# Altium project SC944D.PrjPCB (part 1 of 4)
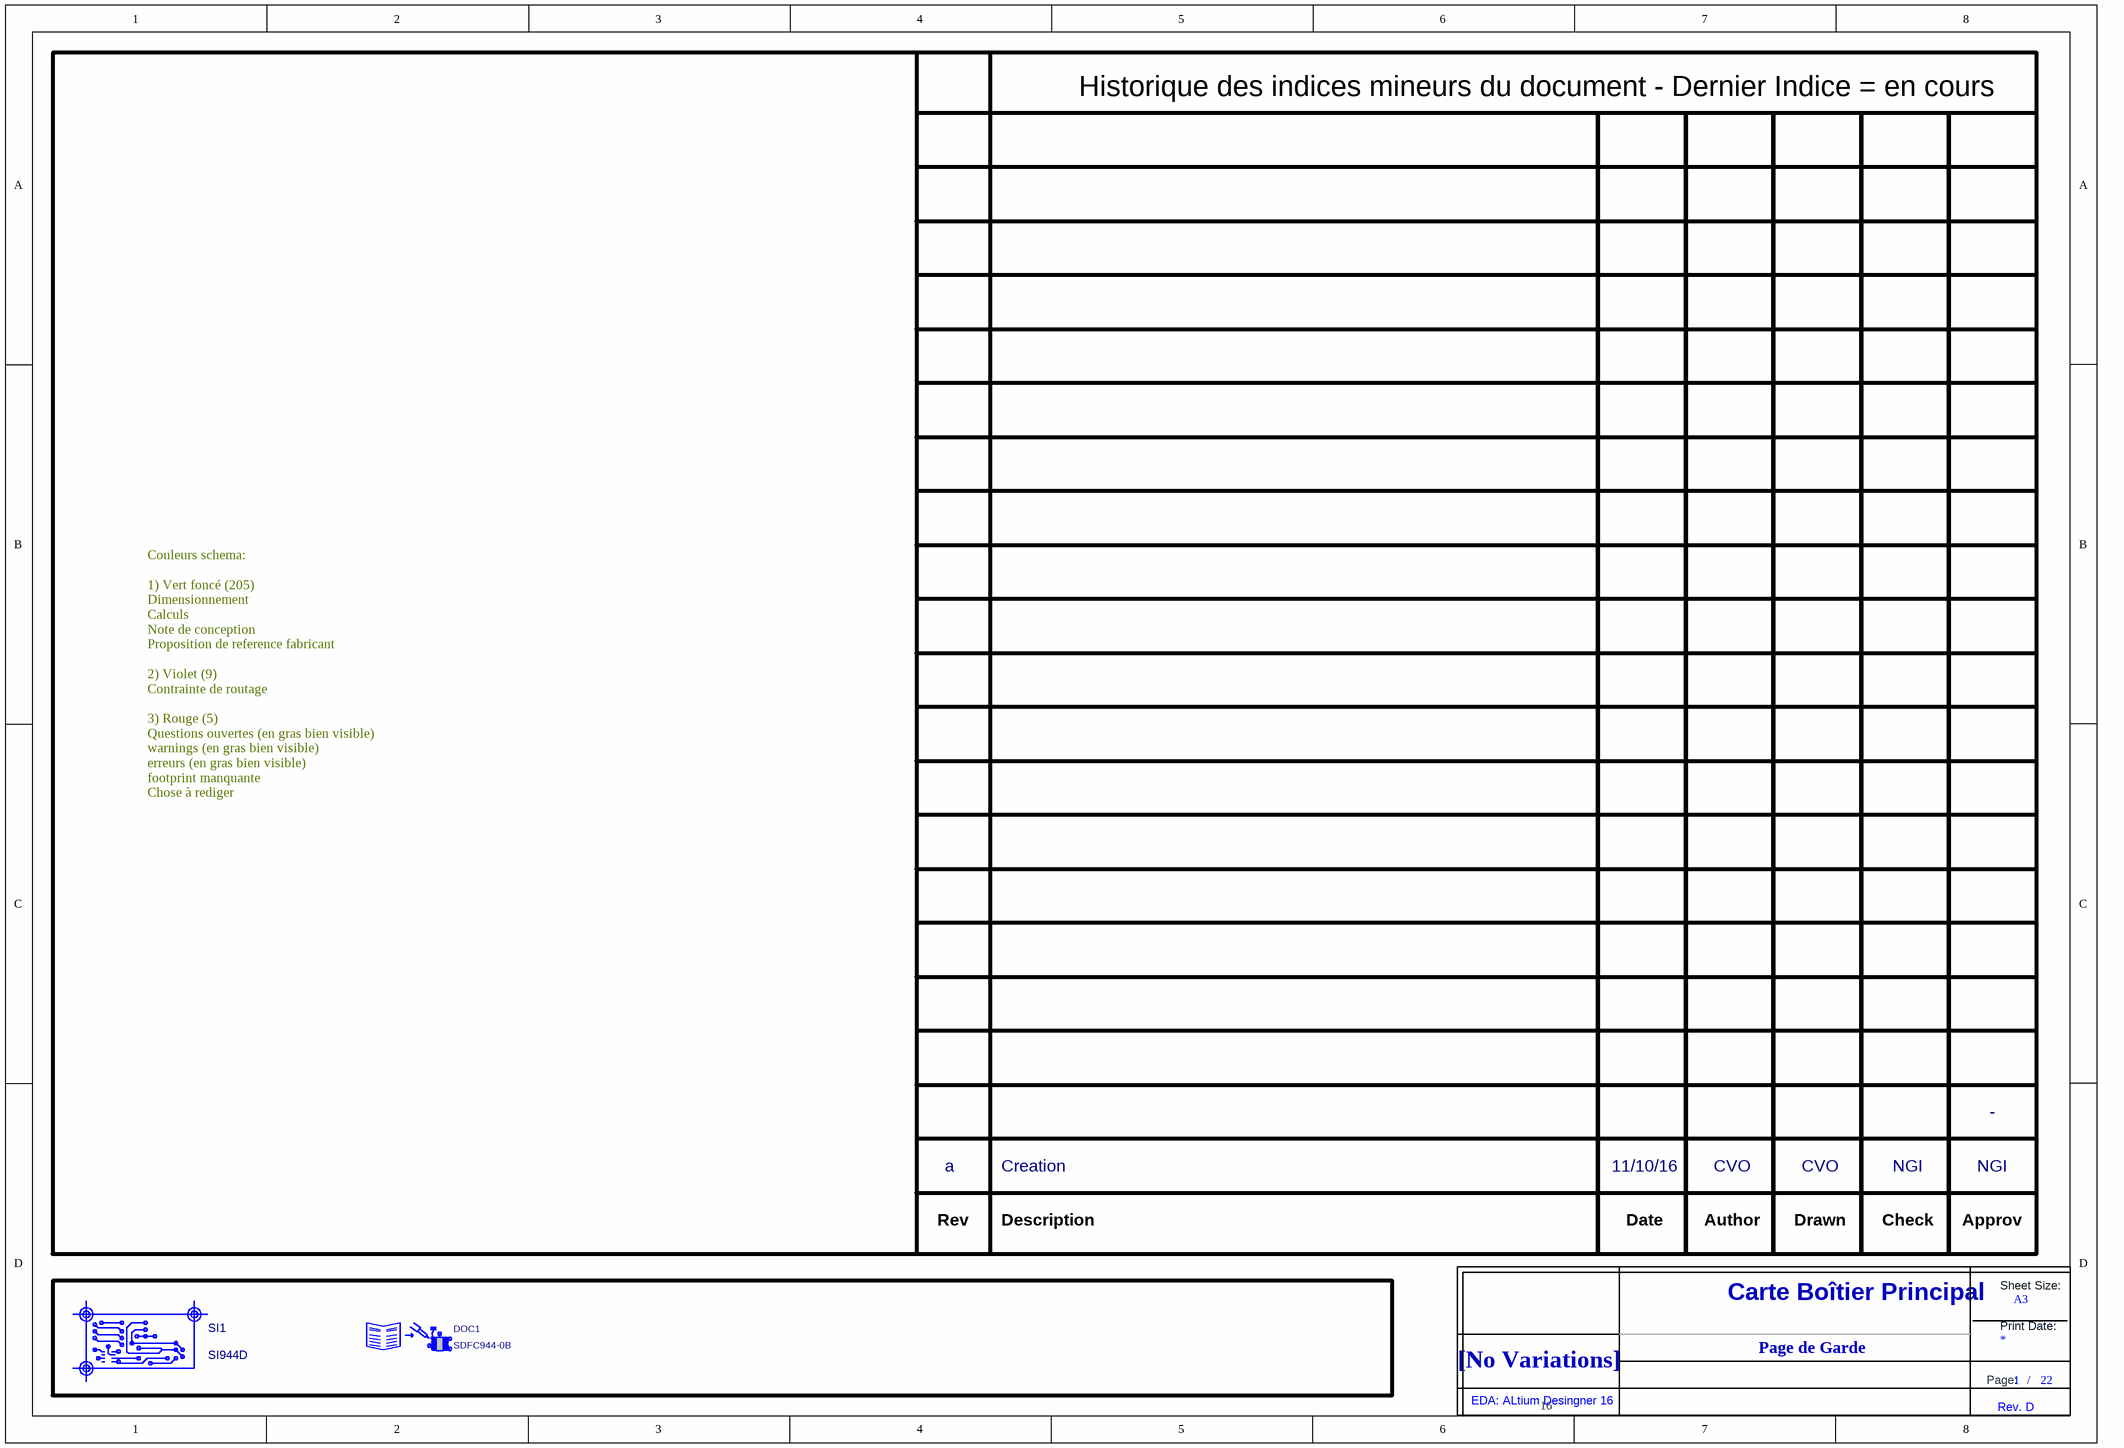
[diagram p0: SDEC944-xD_Page_de_Garde.SchDoc]
_Instructions_SC: Les dates et versions mineurs du SDEC (SC) sont � remplir sur la page ..._infos.doc; _Instructions_SI: Les dates et versions mineurs du SI sont � remplir dans la couche "Cartouche TOP"; prjPcbTitle0: Carte Bo�tier Principal; refSI1: SI944D; SDECSheetSize: A3; SISheetSize: A3
14 sheets, 417 parts. Net scope: global (net labels, ports and power ports of the same name join across sheets).
Board file: SI944D.PcbDoc
Sheets:
  SDEC944-xD_Page_de_Garde.SchDoc
  SDEC944-xD_Alimentation_1-2.SchDoc
  SDEC944-xD_Alimentation_2-2.SchDoc
  SDEC944-xD_Chargeur_Batterie.SchDoc
  SDEC944-xD_Coeur.SchDoc
  SDEC944-xD_Ethernet.SchDoc
  SDEC944-xD_Liaison_IHM.SchDoc
  SDEC944-xD_Arrosage_(detect_pluie+commande_vanne).SchDoc
  SDEC944-xD_Fil_Pilote_1-2_(commun).SchDoc
  SDEC944-xD_Fil_Pilote_2-2_(zone_jour).SchDoc
  SDEC944-xD_Machines_laver_2-2_(commande).SchDoc
  SDEC944-xD_Cumulus.SchDoc
  SDEC944-xD_Porte_tableau_domotique_(ouverture).SchDoc
  SDEC944-xD_Borniers.SchDoc

## Sheet SDEC944-xD_Page_de_Garde.SchDoc: Page de Garde
size 393 x 270 mm; CompanyName: Seccom; Address1: 521, rue du capt. François Garbit; Address2: 69440 Mornant; Address3: seccom@seccom.fr; Address4: www.seccom.fr; DocumentNumber: 1; SheetNumber: 1; SheetTotal: 22; PageSetup: Record=PageOptions|CenterHorizontal=True|CenterVertical=True|PrintScale=0.74|XCorrection=1.00|YCorrection=1.00|PrintKind=0|BorderSize=5000000|LeftOffset=0|BottomOffset=0|Orientation=2|PaperLength=1000|PaperWidth=1000|Scale=100|PaperSource=7|PrintQuality=-4|MediaType=1|DitherType=10|PaperKind=A4|PrintScaleMode=1

### Parts
(Parts that share a designator on the sheet are numbered #1, #2 ... from top to bottom, then left to right.)
DOC1  Reference: SDFC944-0B  (hidden comment: DOCUMENT_FAB_CARTE_SDFC)  (mechanical)
MIR1  MIRE_PICK-N-PLACE  [MIRE_PICK-N-PLACE_D1MM_VE3MM]  (value not drawn)
MIR2  MIRE_PICK-N-PLACE  [MIRE_PICK-N-PLACE_D1MM_VE3MM]  (value not drawn)
MIR3  MIRE_PICK-N-PLACE  [MIRE_PICK-N-PLACE_D1MM_VE3MM]  (value not drawn)
SI1  Reference: SI944D  [CIRCUIT_IMPRIME_SI_STD]
Title_new#1  DNI  (value not drawn)  (graphical)

### Notes on the sheet
- Historique des indices mineurs du document - Dernier Indice = en cours
- Couleurs schema:
  1) Vert foncé (205)
  Dimensionnement
  Calculs
  Note de conception
  Proposition de reference fabricant
  2) Violet (9)
  Contrainte de routage
  3) Rouge (5)
  Questions ouvertes (en gras bien visible)
  warnings (en gras bien visible)
  erreurs (en gras bien visible)
  footprint manquante
  Chose à rediger
- -
- a
- Creation
- 11/10/16
- CVO
- NGI
- Rev
- Description
- Date
- Author
- Drawn
- Check
- Approv
- Page de Garde
- 16
- (in symbol Title_new) Sheet Size:; Carte Boîtier Principal; A3; Print Date:; [No Variations]; Page:; /; EDA: ALtium Desingner 16; Rev. D

### Library data of the parts
DOC1 = DOCUMENT_FAB_CARTE_SDFC: Document de Fabrication pour la Carte SC{Num SC}-{Version SC}; Creation: LJ; Coeff: 0; Verification: *; Boitier: *; Fabricant: *; Ref Fab: *; Config: *; ComponentLink1URL: http://192.168.0.202/index.php/Accueil; ComponentLink2URL: http://192.168.0.202/index.php/Accueil; ComponentLink1Description: Datasheet; ComponentLink2Description: Datasheet Boitier
MIR1-MIR3 = MIRE_PICK-N-PLACE: Mire pour machine de placement CMS "Pick'n Place"; Creation: LJ (25/10/12); Config: NC; Coeff: 0; Value: *
SI1 = CIRCUIT_IMPRIME_MODEL: Circuit Imprimé Seccom; Creation: LJ; Verification: LJ (15/11/04); Remarque: {Remarque}; Coeff: 1; Value: *; Boitier: *; Fabricant: *; Ref Fab: *; ComponentLink1URL: \\SRV_backup\datasheet\; ComponentLink2URL: \\SRV_backup\datasheet\_BOITIERS\; Config: *; ComponentLink1Description: Datasheet; ComponentLink2Description: Datasheet Boitier
Title_new#1 = Title_new

## Sheet SDEC944-xD_Alimentation_1-2.SchDoc: Alimentation 1/2
size 393 x 270 mm; CompanyName: Seccom; Address1: 521, rue du capt. François Garbit; Address2: 69440 Mornant; Address3: seccom@seccom.fr; Address4: www.seccom.fr; DocumentNumber: 2; SheetNumber: 2; SheetTotal: 22; PageSetup: Record=PageOptions|CenterHorizontal=True|CenterVertical=True|PrintScale=0.74|XCorrection=1.00|YCorrection=1.00|PrintKind=0|BorderSize=5000000|LeftOffset=0|BottomOffset=0|Orientation=2|PaperLength=1000|PaperWidth=1000|Scale=100|PaperSource=7|PrintQuality=-4|MediaType=1|DitherType=10|PaperKind=A4|PrintScaleMode=1
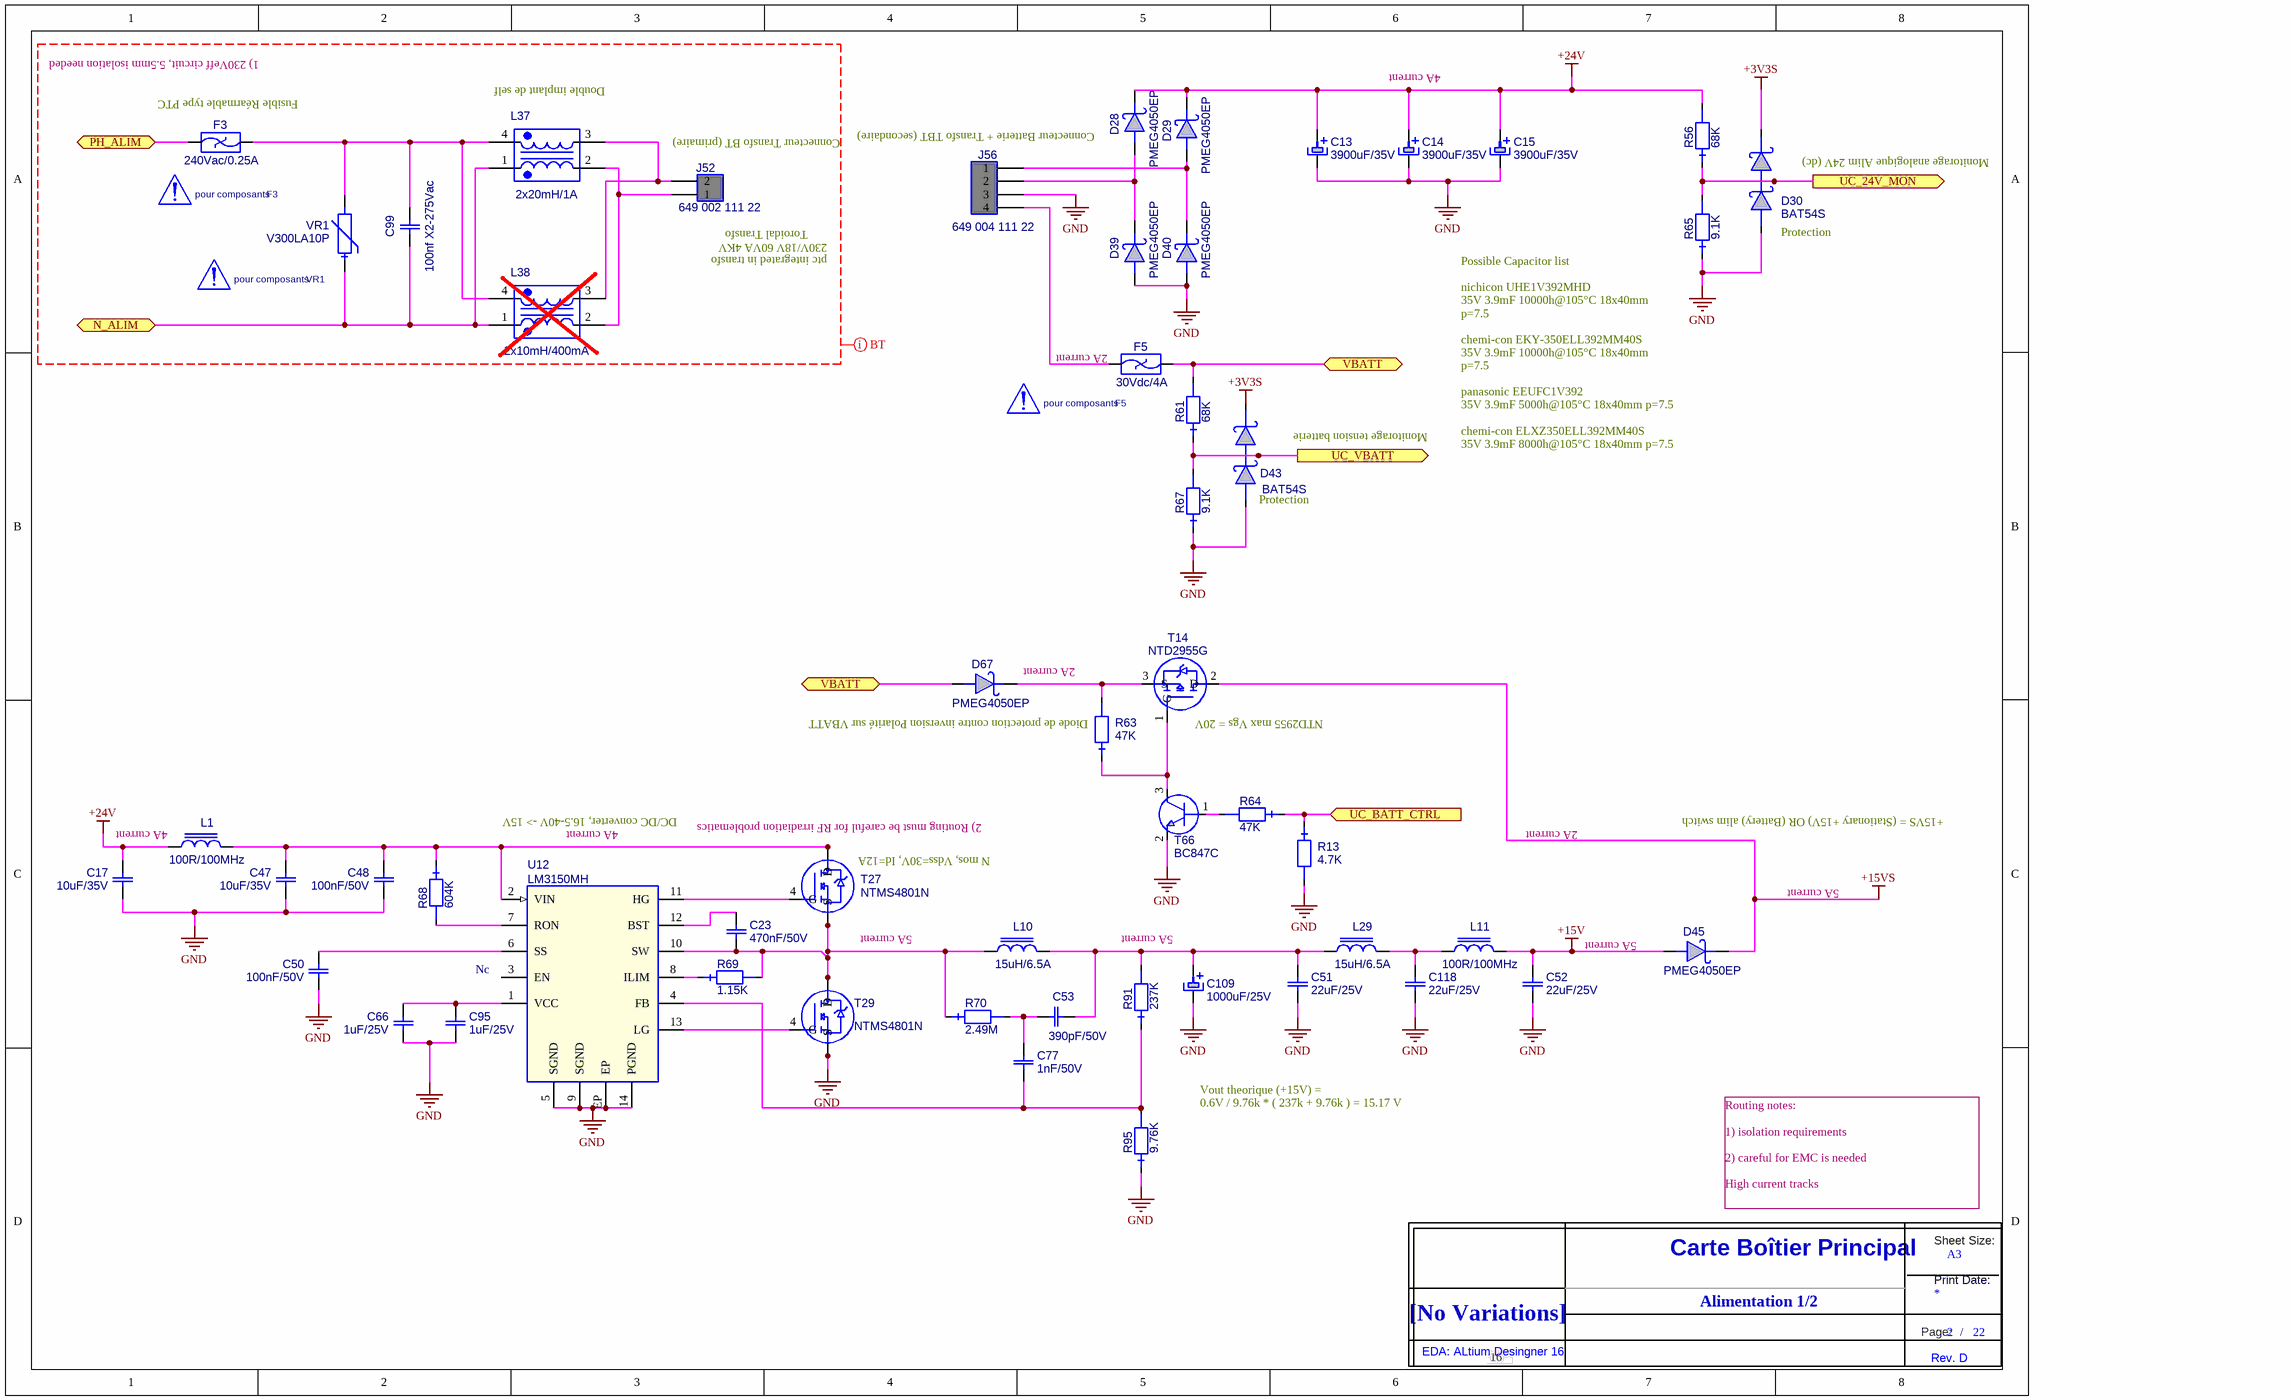
[diagram p1: SDEC944-xD_Alimentation_1-2.SchDoc]

### Parts
(Parts that share a designator on the sheet are numbered #1, #2 ... from top to bottom, then left to right.)
C13  value 3900uF/35V  [CAP_ELE_18X40_E7.5MM]  (hidden comment: C_ELE_3900U_35V_UHE1V392MD)
C14  value 3900uF/35V  [CAP_ELE_18X40_E7.5MM]  (hidden comment: C_ELE_3900U_35V_UHE1V392MD)
C15  value 3900uF/35V  [CAP_ELE_18X40_E7.5MM]  (hidden comment: C_ELE_3900U_35V_UHE1V392MD)
C17  value 10uF/35V  [1210_ReflowSoldering_CAP]  (hidden comment: C_1210_X5R_10%_10U-35V)
C23  value 470nF/50V  [0805_ReflowSoldering_CAP]  (hidden comment: C_0805_X7R_10%_470N-50V)
C47  value 10uF/35V  [1210_ReflowSoldering_CAP]  (hidden comment: C_1210_X5R_10%_10U-35V)
C48  value 100nF/50V  [0603_ReflowSoldering_CAP]  (hidden comment: C_0603_X7R_10%_100N-50V)
C50  value 100nF/50V  [0603_ReflowSoldering_CAP]  (hidden comment: C_0603_X7R_10%_100N-50V)
C51  value 22uF/25V  [1206_ReflowSoldering_CAP]  (hidden comment: C_1206_X5R_20%_22U-25V)
C52  value 22uF/25V  [1206_ReflowSoldering_CAP]  (hidden comment: C_1206_X5R_20%_22U-25V)
C53  value 390pF/50V  [0603_ReflowSoldering_CAP]  (hidden comment: C_0603_NPO_5%_390P-50V)
C66  value 1uF/25V  [0805_ReflowSoldering_CAP]  (hidden comment: C_0805_X5R_10%_1U-25V)
C77  value 1nF/50V  [0603_ReflowSoldering_CAP]  (hidden comment: C_0603_NPO_5%_1N-50V)
C95  value 1uF/25V  [0805_ReflowSoldering_CAP]  (hidden comment: C_0805_X5R_10%_1U-25V)
C99  value 100nf X2-275Vac  [CAP_S_5X17.5_E15MM]  (hidden comment: C_X2_GEN_100NF-275Vac_(4KVmax))
C109  value 1000uF/25V  [CAP_ELE_10X31.5_E5.08MM]  (hidden comment: C_ELE_GEN_20%_1000U-25V)
C118  value 22uF/25V  [1206_ReflowSoldering_CAP]  (hidden comment: C_1206_X5R_20%_22U-25V)
D28  PMEG4050EP  [SOD128_ReflowSoldering]
D29  PMEG4050EP  [SOD128_ReflowSoldering]
D30  BAT54S  [SOT23_3L_ReflowSoldering]
D39  PMEG4050EP  [SOD128_ReflowSoldering]
D40  PMEG4050EP  [SOD128_ReflowSoldering]
D43  BAT54S  [SOT23_3L_ReflowSoldering]
D45  PMEG4050EP  [SOD128_ReflowSoldering]
D67  PMEG4050EP  [SOD128_ReflowSoldering]
F3  value 240Vac/0.25A  [Fus_Poly_11.4x3.8_h19_e5.8]  (hidden comment: FUSIBLE_POLY_240Vac_0.25A_LVR)
F5  value 30Vdc/4A  [Fus_Poly_14.4x3_h24.8_e5.08]  (hidden comment: FUSIBLE_POLY_30V_4A_MF-R400)
J52  value 649 002 111 22  [WR_MPC4_1X02D_Oval_Pad]  (hidden comment: EMB_4.20_M_D_1X02_Oval_PAD)
J56  value 649 004 111 22  [WR_MPC4_1X04D_Oval_PAD]  (hidden comment: EMB_4.20_M_D_1X04_Oval_Pad)
L1  value 100R/100MHz  [1812_ReflowSoldering_SELF]  (hidden comment: IND_FERRITE_1812_74279226101)
L10  value 15uH/6.5A  [SELF_WEPD_12X12_h10_XXL]  (hidden comment: SELF_15UH_6.5A_7447709150)
L11  value 100R/100MHz  [1812_ReflowSoldering_SELF]  (hidden comment: IND_FERRITE_1812_74279226101)
L29  value 15uH/6.5A  [SELF_WEPD_12X12_h10_XXL]  (hidden comment: SELF_15UH_6.5A_7447709150)
L37  value 2x20mH/1A  [SELF_PM3700_17.78x11.43H11.43]  (hidden comment: IND_FERRITE_PM3700_80_RC_2X20mH)
L38  value 2x10mH/400mA  [SELF_WE-LF_SH_18.5x23.3H11.5mm]  (hidden comment: IND_FERRITE_WE_LF_SH_7446631010_2X10mH)  (no BOM)
NOTE1  value F5  [NULL]  (hidden comment: NOTE_POUR_NOMENCLATURE_COMP)
NOTE2  value VR1  [NULL]  (hidden comment: NOTE_POUR_NOMENCLATURE_COMP)
NOTE3  value F3  [NULL]  (hidden comment: NOTE_POUR_NOMENCLATURE_COMP)
R13  value 4.7K  [0603_ReflowSoldering_RES]  (hidden comment: RES_0603_1%_100PPM_4.7K)
R56  value 68K  [0603_ReflowSoldering_RES]  (hidden comment: RES_0603_1%_100PPM_68K)
R61  value 68K  [0603_ReflowSoldering_RES]  (hidden comment: RES_0603_1%_100PPM_68K)
R63  value 47K  [0603_ReflowSoldering_RES]  (hidden comment: RES_0603_1%_100PPM_47K)
R64  value 47K  [0603_ReflowSoldering_RES]  (hidden comment: RES_0603_1%_100PPM_47K)
R65  value 9.1K  [0603_ReflowSoldering_RES]  (hidden comment: RES_0603_1%_100PPM_9.1K)
R67  value 9.1K  [0603_ReflowSoldering_RES]  (hidden comment: RES_0603_1%_100PPM_9.1K)
R68  value 604K  [0603_ReflowSoldering_RES]  (hidden comment: RES_0603_1%_100PPM_604K)
R69  value 1.15K  [0603_ReflowSoldering_RES]  (hidden comment: RES_0603_1%_100PPM_1.15K)
R70  value 2.49M  [0603_ReflowSoldering_RES]  (hidden comment: RES_0603_1%_100PPM_2.49M)
R91  value 237K  [0603_ReflowSoldering_RES]  (hidden comment: RES_0603_1%_100PPM_237K)
R95  value 9.76K  [0603_ReflowSoldering_RES]  (hidden comment: RES_0603_1%_100PPM_9.76K)
T14  NTD2955G  [DPAK_Specifique_1]
T27  NTMS4801N  [SOIC_08_E1,27_L150_ReflowSoldering]
T29  NTMS4801N  [SOIC_08_E1,27_L150_ReflowSoldering]
T66  BC847C  [SOT23_3L_ReflowSoldering]
Title_new#2  DNI  (value not drawn)  (graphical)
U12  value LM3150MH  [eTSSOP_014_E0,65_L4,4MM]  (hidden comment: LM3150)
VR1  value V300LA10P  [VDR_Serie_LA_d10_h16_e7.5mm]  (hidden comment: VDR_V300LA10P)

### Ports
N_ALIM (bidir), PH_ALIM (bidir), UC_24V_MON (out), UC_BATT_CTRL (in), UC_VBATT (out), VBATT (bidir)

### Nets
+3V3S: D30.2 D43.2
+15V: C52.2 D45.A L11.2
+15VS: D45.K T14.2(D)
+24V: C13.2 C14.2 C15.2 C17.2 D28.K D29.K L1.1 R56.2
GND: C13.1 C14.1 C15.1 C17.1 C47.1 C48.2 C50.2 C51.1 C52.1 C66.1 C95.1 C109.1 C118.1 D30.1 D39.A D40.A D43.1 J56.3 R13.2 R65.1 R67.1 R95.1 T29.1(S) T29.2(S) T29.3(S) T66.2(E) U12.5(SGND) U12.9(SGND) U12.14(PGND) U12.EP
N_ALIM: C99.2 L37.1 L38.1 VR1.1 ; port N_ALIM
PH_ALIM: F3.1 ; port PH_ALIM
UC_24V_MON: D30.3 R56.1 R65.2 ; port UC_24V_MON
UC_BATT_CTRL: R13.1 R64.1 ; port UC_BATT_CTRL
UC_VBATT: D43.3 R61.1 R67.2 ; port UC_VBATT
VBATT: D67.A F5.2 R61.2 ; port VBATT
NetC23_1: C23.1 L10.1 R69.2 R70.1 T27.1(S) T27.2(S) T27.3(S) T29.5(D) T29.6(D) T29.7(D) T29.8(D) U12.10(SW)
NetC23_2: C23.2 U12.12(BST)
NetC47_2: C47.2 C48.1 L1.2 R68.1 T27.5(D) T27.6(D) T27.7(D) T27.8(D) U12.2(VIN)
NetC50_1: C50.1 U12.6(SS)
NetC51_2: C51.2 C53.1 C109.2 L10.2 L29.1 R91.2
NetC53_2: C53.2 C77.2 R70.2
NetC66_2: C66.2 C95.2 U12.1(VCC)
NetC77_1: C77.1 R91.1 R95.2 U12.4(FB)
NetC99_1: C99.1 F3.2 L37.4 L38.4 VR1.2
NetC118_2: C118.2 L11.1 L29.2
NetD28_A: D28.A D39.K J56.2
NetD29_A: D29.A D40.K J56.1
NetD67_K: D67.K R63.2 T14.3(S)
NetF5_1: F5.1 J56.4
NetJ52_1: J52.1 L37.2 L38.2
NetJ52_2: J52.2 L37.3 L38.3
NetR63_1: R63.1 T14.1(G) T66.3(C)
NetR64_2: R64.2 T66.1(B)
NetR68_2: R68.2 U12.7(RON)
NetR69_1: R69.1 U12.8(ILIM)
NetT27_4: T27.4(G) U12.11(HG)
NetT29_4: T29.4(G) U12.13(LG)

Not connected (* = marked no-connect by the designer): L10 3 4 5 6; L29 3 4 5 6; U12 3(EN)

### Layout directives
net class BT: (no net found under the mark)

### Notes on the sheet
- 1) 230Veff circuit, 5.5mm isolation needed
- (near F3) Fusible Réarmable type PTC
- (near L37) Double implant de self
- 4A current
- (near J52) Connecteur Transfo BT (primaire)
- Connecteur Batterie + Transfo TBT (secondaire)
- (near D30) Monitorage analogique Alim 24V (dc)
- (near J52) Toroidal Transfo
- ptc integrated in transfo
- 230V/18V 60VA 4KV
- (near D30) Protection
- (near F5) 2A current
- (near D43) Monitorage tension batterie
- (near D43) Protection
- (near R65) Possible Capacitor list
  nichicon UHE1V392MHD
  35V 3.9mF 10000h@105°C 18x40mm p=7.5
  chemi-con EKY-350ELL392MM40S
  35V 3.9mF 10000h@105°C 18x40mm p=7.5
  panasonic EEUFC1V392
  35V 3.9mF 5000h@105°C 18x40mm p=7.5
  chemi-con ELXZ350ELL392MM40S
  35V 3.9mF 8000h@105°C 18x40mm p=7.5
  Verifier ripple max (mAmps)
- (near D67) 2A current
- (near R63) Diode de protection contre inversion Polarité sur VBATT
- (near T14) NTD2955 max Vgs = 20V
- (near L1) 4A current
- DC/DC converter, 16.5-40V -> 15V
- (near T27) 2) Routing must be careful for RF irradiation problematics
- 2A current
- +15VS = (Stationary +15V) OR (Battery) alim switch
- (near T27) N mos, Vdss=30V, Id=12A
- 5A current
- Nc
- Vout theorique (+15V) =
  0.6V / 9.76k * ( 237k + 9.76k ) = 15.17 V
- Routing notes:
  1) isolation requirements
  2) careful for EMC is needed
  High current tracks
- Alimentation 1/2
- 16
- (in symbol NOTE_POUR_NOMENCLATURE_COMP) pour composants
- (in symbol Title_new) Sheet Size:; Carte Boîtier Principal; A3; Print Date:; [No Variations]; Page:; /; EDA: ALtium Desingner 16; Rev. D

### Library data of the parts
C13-C15 = C_ELE_3900U_35V_UHE1V392MD: Condensateurs électrolytiques aluminium traversant 35volts 3900uF 105c 18x40 P7.5; Creation: PDP (02/12/10); Boitier: 18x40mm p7.5mm; Remarque: {Remarque}; Fabricant: Nichicon; Ref Fab: UHE1V392MHD; Coeff: 1; Config: *; ComponentLink1Description: Datasheet; ComponentLink1URL: O:\_Documentation\Datasheets\Nichicon\e-he nichicon.pdf; ComponentLink2Description: Datasheet Boitier; ComponentLink2URL: o:\_Documentation\Datasheets\_BOITIERS\; Supplier 1: Mouser; Supplier Part Number 1: 647-UHE1V392MHD
C17 C47 = C_1210_X5R_10%_10U-35V: Condensateur céramique, X5R, 10%, CMS 1210; Creation: LJ (09/02/09); Reference: 000265/00; Boitier: 1210; Remarque: {Remarque}; Coeff: 1; Fabricant: Taiyo Yuden; Ref Fab: GMK325BJ106KN-T; Verification: *; ComponentLink1URL: o:\_Documentation\Datasheets\TaiyoYuden\High_Value_Multilayer_Ceramic_Caps.pdf; ComponentLink2URL: o:\_Documentation\Datasheets\_Boitiers\PASSIF_CMS\C_1210_(3,2x2,5)_(Schneider).pdf; Config: *; ComponentLink1Description: Datasheet; ComponentLink2Description: Datasheet Boitier
C23 = C_0805_X7R_10%_470N-50V: Condensateur céramique, X7R, 10%, CMS 0805, 470nF/50V; Creation: FB (02/10/12); Boitier: 0805; Remarque: {Remarque}; Coeff: 1; Fabricant: Kemet; Ref Fab: C0805C471K5RAC; Verification: *; ComponentLink1URL: O:\_Documentation\Datasheets\Kemet\Condos_Ceramic_CMS.pdf; ComponentLink2URL: o:\_Documentation\Datasheets\_BOITIERS\PASSIF_CMS\RC_0805_(2x1,25)_(Schneider).PDF; Config: *; ComponentLink1Description: Datasheet; ComponentLink2Description: Datasheet Boitier; Supplier 1: Mouser; Supplier Part Number 1: 80-C0805C471K5R
C48 C50 = C_0603_X7R_10%_100N-50V: Condensateur céramique, X7R, 10%, CMS 0603, 100nF/50V; Creation: FB (29/02/12); Boitier: 0603; Remarque: {Remarque}; Fabricant: Kemet; Ref Fab: C0603C104K5RAC; Coeff: 1; ComponentLink1URL: O:\_Documentation\Datasheets\Kemet\Condos_Ceramic_CMS.pdf; ComponentLink2URL: o:\_Documentation\Datasheets\_BOITIERS\PASSIF_CMS\; Config: *; ComponentLink1Description: Datasheet; ComponentLink2Description: Datasheet Boitier; Supplier 1: Farnell; Supplier Part Number 1: 1288255
C51 C52 C118 = C_1206_X5R_20%_22U-25V: Condensateur céramique, X5R, 20%, CMS 1206, 22uF/25V; Creation: ZA (18/12/13); Reference: /01; Boitier: 1206; Remarque: {Remarque}; Fabricant: TDK; Coeff: 1; Ref Fab: C3216X5R1E226M160AB; Verification: *; ComponentLink1URL: O:\_Documentation\Datasheets\TDK\general_B11.pdf; ComponentLink2URL: o:\_Documentation\Datasheets\_BOITIERS\PASSIF_CMS\; ComponentLink1Description: Datasheet; ComponentLink2Description: Datasheet Boitier; Supplier 1: Farnell; Supplier Part Number 1: 2354129; Supplier 2: Mouser; Supplier Part Number 2: 810-C3216X5R1E226M
C53 = C_0603_NPO_5%_390P-50V: Condensateur céramique, NPO, 5%, CMS 0603; Creation: CHD; Boitier: 0603; Remarque: {Remarque}; Coeff: 1; Fabricant: Kemet; Ref Fab: C0603C391J5GAC; ComponentLink1URL: o:\_Documentation\Datasheets\Kemet\Condos_Ceramic_CMS.pdf; ComponentLink2URL: o:\_Documentation\Datasheets\_BOITIERS\PASSIF_CMS\; Config: *; ComponentLink1Description: Datasheet; ComponentLink2Description: Datasheet Boitier; Supplier 1: Farnell; Supplier 2: Mouser; Supplier Part Number 1: 1414638; Supplier Part Number 2: 80-C0603C391J5G
C66 C95 = C_0805_X5R_10%_1U-25V: Condensateur céramique, X5R, 10%, CMS 0805; Creation: FB (07/03/12); Reference: 001834/00; Boitier: 0805; Remarque: {Remarque}; Coeff: 1; Fabricant: AVX; Ref Fab: 08053D105KAT2A; Verification: *; ComponentLink1URL: O:\_Documentation\Datasheets\AVX\Condensateurs_CMS_Ceramic_X5R.pdf; ComponentLink2URL: o:\_Documentation\Datasheets\_Boitiers\PASSIF_CMS\RC_0805_(2x1,25)_(Schneider).pdf; Config: *; ComponentLink1Description: Datasheet; ComponentLink2Description: Datasheet Boitier; Supplier Part Number 1: 1327695; Supplier Part Number 2: 6983409; Supplier 1: Farnell; Supplier 2: Radiospares
C77 = C_0603_NPO_5%_1N-50V: Condensateur céramique, NPO, 5%, CMS 0603; Creation: LJ; Reference: 001809/00; Boitier: 0603; Remarque: {Remarque}; Coeff: 1; Fabricant: AVX; Ref Fab: 06035A102JAT2A; ComponentLink1URL: o:\_Documentation\Datasheets\BC_Components\Condo_CMS_NPO-X7R-Y5V.pdf; ComponentLink2URL: o:\_Documentation\Datasheets\_BOITIERS\PASSIF_CMS\; Config: *; ComponentLink1Description: Datasheet; ComponentLink2Description: Datasheet Boitier; Supplier 1: Mouser; Supplier Part Number 1: 581-06035A102J
C99 = C_X2_GEN_100NF-275Vac_(4KVmax): Condensateur polypropylene métallisé X2, 20%,100nF/275Vac,-40/+110°C, radial; Creation: ZA (02/10/12); Reference: 001910/00; Boitier: 17.5x5_h12_e15_p0.9mm; Remarque: existe en 10%; Fabricant: Panasonic; Ref Fab: ECQUAAF104M; Coeff: 1; ComponentLink1URL: o:\_Documentation\Datasheets\Panasonic\CONDO_SERIE_ECQUA_X2.pdf; ComponentLink2URL: o:\_Documentation\Datasheets\Panasonic\CONDO_SERIE_ECQUA_X2.pdf; ComponentLink1Description: Datasheet; ComponentLink2Description: Datasheet Boitier; Supplier 1: Mouser; Supplier Part Number 1: 667-ECQ-UAAF104M; Supplier 2: Farnell; Supplier Part Number 2: 1907246
C109 = C_ELE_GEN_20%_1000U-25V: Condensateur Electro, ultra Low ESR (31mR@100kHz), +/-20%, 7000h, 1.9ARms, -40/+105°C; Creation: ZA (12/04/13); Boitier: d10_h31.5_e5mm; Remarque: {Remarque}; Fabricant: Nichicon; Ref Fab: UHE1E102MPD; Coeff: 1; Verification: *; Reference: *; Config: *; ComponentLink1Description: Datasheet; ComponentLink1URL: o:\_Documentation\Datasheets\Nichicon\e-he_nichicon.pdf; ComponentLink2Description: Datasheet Boitier; ComponentLink2URL: o:\_Documentation\Datasheets\_BOITIERS\; Supplier 1: Farnell; Supplier Part Number 1: 1823555; Supplier 2: Mouser; Supplier Part Number 2: 647-UHE1E102MPD
D28 D29 D39 D40 D45 D67 = PMEG4050EP: Diode Schottky, Vrrm=30V, If=5A(aver), Vf=0.315V, CMS; Creation: PDP (25/09/12); Boitier: SOD128; Remarque: {Remarque}; Coeff: 1; Fabricant: NXP; Verification: *; ComponentLink1URL: o:\_Documentation\Datasheets\NXP\PMEG4050EP.pdf; ComponentLink2URL: o:\_Documentation\Datasheets\_BOITIERS\ACTIF_CMS\SOD\; Config: *; ComponentLink1Description: Datasheet; ComponentLink2Description: Datasheet Boitier; Ref Fab: PMEG4050EP; Value: PMEG4050EP; Supplier 1: Mouser; Supplier 2: Farnell; Supplier Part Number 1: 771-PMEG4050EP115; Supplier Part Number 2: 1829203RL
D30 D43 = BAT54S: Diode Schottky double, BAT54 en série, Vrrm=30V, If=200mA, Vf=0.4Vmax, CMS; Creation: JMP 05/09/2002; Verification: GO (26/09/02); Reference: 000206/00; Boitier: SOT23_3L; Remarque: {Remarque}; Coeff: 1; Fabricant: NXP; ComponentLink1URL: O:\_Documentation\Datasheets\NXP\BAT54_series.pdf; ComponentLink2URL: o:\_Documentation\Datasheets\_BOITIERS\ACTIF_CMS\SOT\SOT_23_3P_(Schneider).PDF; Config: *; ComponentLink1Description: Datasheet; ComponentLink2Description: Datasheet Boitier; Ref Fab: BAT54S; Supplier 1: Farnell; Supplier Part Number 1: 1081194; Value: BAT54S; Supplier 2: Mouser; Supplier Part Number 2: 771-BAT54S-T/R
F3 = FUSIBLE_POLY_240Vac_0.25A_LVR: Fusible Polyswitch série LVR, Vmax=265Vac, Ihold=0.25A, Itrip=0.56A, 1.5W; Creation: ZA (23/04/13); Boitier: type R8 : 11.4x3.8_e5.08mm, H19; Remarque: {Remarque}; Coeff: 1; Fabricant: TYCO Electronics; Ref Fab: LVR025K; Verification: *; Config: *; ComponentLink1Description: Datasheet; ComponentLink1URL: o:\_Documentation\Datasheets\Tyco\Tyco=TE Connectivity\Polyswitch_LVR.pdf; ComponentLink2Description: Datasheet Boitier; ComponentLink2URL: o:\_Documentation\Datasheets\_BOITIERS\; Supplier 1: Farnell; Supplier Part Number 1: 1175835; Supplier 2: Mouser; Supplier Part Number 2: 650-LVR025K-2
F5 = FUSIBLE_POLY_30V_4A_MF-R400: Fusible Polyswitch, 30Vcc, Ihold=4A, Itrip=8A; Creation: ZA (31/10/12); Boitier: 14.4x3.1_e5.08mm; Remarque: {Remarque}; Coeff: 1; Fabricant: Bourns; Verification: *; ComponentLink1URL: o:\_Documentation\Datasheets\Bourns\POLYSWITCH_MFR.pdf; ComponentLink2URL: o:\_Documentation\Datasheets\_BOITIERS\; Config: *; ComponentLink1Description: Datasheet; ComponentLink2Description: Datasheet Boitier; Ref Fab: MF-R400; Supplier 1: Farnell; Supplier Part Number 1: 9350527; Supplier 2: Mouser; Supplier Part Number 2: 652-MFR400
J52 = EMB_4.20_M_D_1X02_Oval_PAD: Connecteur Wurth, pas 4.2mm, 1x2 picots, 9A, 600V; Creation: ZA (04/10/12); Boitier: 9.6x5.4_h12.8mm; Coeff: 1; Fabricant: Wurth Electronik; Ref Fab: 64900211122; ComponentLink1URL: O:\_Documentation\Datasheets\Wurth_Elektronik\6490xx11122.pdf; Config: *; ComponentLink1Description: Datasheet; ComponentLink2Description: Datasheet Boitier; Supplier 1: Farnell; Supplier Part Number 1: 2113396
J56 = EMB_4.20_M_D_1X04_Oval_Pad: Connecteur Wurth, pas 4.2mm, 1x4 picots, 8A; Creation: ZA (29/10/12); Boitier: 18x5.4_h12.8mm; Coeff: 1; Fabricant: Wurth Electronik; Ref Fab: 64900411122; ComponentLink1URL: O:\_Documentation\Datasheets\Wurth_Elektronik\6490xx11122.pdf; Config: *; ComponentLink1Description: Datasheet; ComponentLink2Description: Datasheet Boitier; Supplier 1: Farnell; Supplier Part Number 1: 2113398
L1 L11 = IND_FERRITE_1812_74279226101: Inductance à ferrite multicouches CMS, imp=100R@>100MHz, +/-25%, Rdc=6mR, I=8A; Creation: PDP (20/09/12); Boitier: 1812; Coeff: 1; Fabricant: Wurth Elektronik; ComponentLink1URL: O:\_Documentation\Datasheets\Wurth_Elektronik\74279226101.pdf; Config: *; ComponentLink1Description: Datasheet; ComponentLink2Description: Datasheet Boitier; Ref Fab: 74279226101; Supplier 1: Mouser; Supplier Part Number 1: 710-74279226101; Supplier 2: Farnell; Supplier Part Number 2: 2066855
L10 L29 = SELF_15UH_6.5A_7447709150: Inductance bobinée CMS, 15uH +/- 20%, I=6.5A, Rdc=0.026R, SRF=17MHz, -40/+85°C; Creation: PDP (20/09/12); Boitier: WE-PD_12x12_h10mm_typeXXL; Coeff: 1; Fabricant: Wurth Elektronik; Verification: *; ComponentLink1URL: O:\_Documentation\Datasheets\Wurth_Elektronik\7447709150.pdf; ComponentLink2URL: O:\_Documentation\Datasheets\Wurth_Elektronik\7447709150.pdf; Remarque: *; Config: *; ComponentLink1Description: Datasheet; ComponentLink2Description: Datasheet Boitier; Ref Fab: 7447709150; Supplier 1: Mouser; Supplier Part Number 1: 710-7447709150; Supplier 2: Farnell; Supplier Part Number 2: 1635944
L37 = IND_FERRITE_PM3700_80_RC_2X20mH: Filtre double ferrite, 2x20mH, 250Vac, 1A, serie PM3700, -55/+125°C, CMS; Creation: ZA (12/04/13); Boitier: PM3700_17.78x11.43_h11.43mm; Coeff: 1; Fabricant: Bourns; Ref Fab: PM3700-80-RC; Verification: *; Reference: *; ComponentLink1URL: o:\_Documentation\Datasheets\Bourns\SELF_PM3700.pdf; ComponentLink2URL: o:\_Documentation\Datasheets\_BOITIERS\; Config: *; ComponentLink1Description: Datasheet; ComponentLink2Description: Datasheet Boitier; Supplier 1: Mouser; Supplier Part Number 1: 542-PM3700-80-RC; Supplier 2: RS; Supplier Part Number 2: 736-1141
L38 = IND_FERRITE_WE_LF_SH_7446631010_2X10mH: Filtre double ferrite, 2x10mH, 250Vac, 400mA, serie WE-LF-SH, -25/+125°C, CMS; Creation: ZA (12/04/13); Boitier: WE-LF-SH_18.5x23.3_h11.5mm; Coeff: 1; Fabricant: Wurth Elektronik; Verification: *; Reference: *; ComponentLink1URL: o:\_Documentation\Datasheets\Wurth_Elektronik\7446631010.pdf; ComponentLink2URL: o:\_Documentation\Datasheets\_BOITIERS\; Config: *; ComponentLink1Description: Datasheet; ComponentLink2Description: Datasheet Boitier; Ref Fab: 7446631010
NOTE1 = NOTE_POUR_NOMENCLATURE_COMP: Coucher F5 pour limiter la hauteur; Creation: LJ; Verification: LJ (11/01/05); Remarque: Dans la description NE PAS UTILISER LA TOUCHE ENTREE ! Sinon erreur lors du traitement de la nomenclature !; Coeff: 1; Reference: *; Boitier: *; Fabricant: *; Ref Fab: *; ComponentLink1URL: \\SRV_backup\datasheet\; ComponentLink2URL: \\SRV_backup\datasheet\_BOITIERS\; Config: *; ComponentLink1Description: Datasheet; ComponentLink2Description: Datasheet Boitier
NOTE2 = NOTE_POUR_NOMENCLATURE_COMP: Incliner VR1 pour limiter la hauteur; Creation: LJ; Verification: LJ (11/01/05); Remarque: Dans la description NE PAS UTILISER LA TOUCHE ENTREE ! Sinon erreur lors du traitement de la nomenclature !; Coeff: 1; Reference: *; Boitier: *; Fabricant: *; Ref Fab: *; ComponentLink1URL: \\SRV_backup\datasheet\; ComponentLink2URL: \\SRV_backup\datasheet\_BOITIERS\; Config: *; ComponentLink1Description: Datasheet; ComponentLink2Description: Datasheet Boitier
NOTE3 = NOTE_POUR_NOMENCLATURE_COMP: Coucher F3 pour limiter la hauteur; Creation: LJ; Verification: LJ (11/01/05); Remarque: Dans la description NE PAS UTILISER LA TOUCHE ENTREE ! Sinon erreur lors du traitement de la nomenclature !; Coeff: 1; Reference: *; Boitier: *; Fabricant: *; Ref Fab: *; ComponentLink1URL: \\SRV_backup\datasheet\; ComponentLink2URL: \\SRV_backup\datasheet\_BOITIERS\; Config: *; ComponentLink1Description: Datasheet; ComponentLink2Description: Datasheet Boitier
R13 = RES_0603_1%_100PPM_4.7K: Résistance, 0.100W, 1%, 100ppm, 75V, 4.7K; Creation: JPL (05/07/12); Boitier: 0603; Remarque: {Remarque}; Fabricant: Vishay; Ref Fab: CRCW06034K70FKEA; Coeff: 1; Verification: *; ComponentLink1URL: O:\_Documentation\Datasheets\Vishay\Resistances_D-CRCWe3.pdf; ComponentLink2URL: o:\_Documentation\Datasheets\_BOITIERS\PASSIF_CMS\; Config: *; ComponentLink1Description: Datasheet; ComponentLink2Description: Datasheet Boitier; Supplier 1: Farnell; Supplier 2: RadioSpares; Supplier Part Number 1: 1469807; Supplier Part Number 2: 6790484
R56 R61 = RES_0603_1%_100PPM_68K: Résistance, 0.100W, 1%, 100ppm, 75V, 68K; Creation: PDP (19/09/12); Boitier: 0603; Remarque: {Remarque}; Fabricant: Vishay; Ref Fab: CRCW060368K0FKEA; Coeff: 1; Verification: *; ComponentLink1URL: O:\_Documentation\Datasheets\Vishay\Resistances_D-CRCWe3.pdf; ComponentLink2URL: o:\_Documentation\Datasheets\_BOITIERS\PASSIF_CMS\; Config: *; ComponentLink1Description: Datasheet; ComponentLink2Description: Datasheet Boitier; Supplier 1: Mouser; Supplier Part Number 1: 71-CRCW0603-68K-E3; Supplier 2: Farnell; Supplier Part Number 2: 1469832RL
R63 R64 = RES_0603_1%_100PPM_47K: Résistance, 0.100W, 1%, 100ppm, 75V, 47K; Creation: JPL (05/07/12); Boitier: 0603; Remarque: {Remarque}; Fabricant: Vishay; Ref Fab: CRCW060347K0FKEA; Coeff: 1; Verification: *; ComponentLink1URL: O:\_Documentation\Datasheets\Vishay\Resistances_D-CRCWe3.pdf; ComponentLink2URL: o:\_Documentation\Datasheets\_BOITIERS\PASSIF_CMS\; Config: *; ComponentLink1Description: Datasheet; ComponentLink2Description: Datasheet Boitier; Supplier 1: Farnell; Supplier 2: RadioSpares; Supplier Part Number 1: 1469811; Supplier Part Number 2: 6790425
R65 R67 = RES_0603_1%_100PPM_9.1K: Résistance, 0.100W, 1%, 100ppm, 75V, 9.1K; Creation: PDP (03/09/12); Boitier: 0603; Remarque: {Remarque}; Fabricant: Vishay; Ref Fab: CRCW06039K10FKEA; Coeff: 1; ComponentLink1URL: O:\_Documentation\Datasheets\Vishay\Resistances_D-CRCWe3.pdf; ComponentLink2URL: o:\_Documentation\Datasheets\_BOITIERS\PASSIF_CMS\; Config: *; ComponentLink1Description: Datasheet; ComponentLink2Description: Datasheet Boitier; Supplier 1: Mouser; Supplier Part Number 1: 71-CRCW0603-9.1K-E3; Supplier 2: Farnell; Supplier Part Number 2: 1469842RL
R68 = RES_0603_1%_100PPM_604K: Résistance, 0.100W, 1%, 100ppm, 75V, 604K; Creation: PDP (20/09/12); Boitier: 0603; Remarque: {Remarque}; Fabricant: Vishay; Ref Fab: CRCW0603604KFKEA; Coeff: 1; Verification: *; ComponentLink1URL: O:\_Documentation\Datasheets\Vishay\Resistances_D-CRCWe3.pdf; ComponentLink2URL: o:\_Documentation\Datasheets\_BOITIERS\PASSIF_CMS\; Config: *; ComponentLink1Description: Datasheet; ComponentLink2Description: Datasheet Boitier; Supplier 1: Mouser; Supplier Part Number 1: 71-CRCW0603-604K-E3; Supplier 2: Farnell; Supplier Part Number 2: 1152086
R69 = RES_0603_1%_100PPM_1.15K: Résistance, 0.100W, 1%, 100ppm, 75V, 1.15K; Creation: PDP (20/09/12); Boitier: 0603; Remarque: {Remarque}; Fabricant: Vishay; Ref Fab: CRCW06031K15FKEA; Coeff: 1; Verification: *; ComponentLink1URL: O:\_Documentation\Datasheets\Vishay\Resistances_D-CRCWe3.pdf; ComponentLink2URL: o:\_Documentation\Datasheets\_BOITIERS\PASSIF_CMS\; Config: *; ComponentLink1Description: Datasheet; ComponentLink2Description: Datasheet Boitier; Supplier 1: Mouser; Supplier Part Number 1: 71-CRCW0603-1.15K-E3; Supplier 2: Farnell; Supplier Part Number 2: 2138355
R70 = RES_0603_1%_100PPM_2.49M: Résistance, 0.100W, 1%, 100ppm, 75V, 2.49M; Creation: PDP (20/09/12); Boitier: 0603; Remarque: {Remarque}; Fabricant: Vishay; Ref Fab: CRCW06032M49FKEA; Coeff: 1; Verification: *; ComponentLink1URL: O:\_Documentation\Datasheets\Vishay\Resistances_D-CRCWe3.pdf; ComponentLink2URL: o:\_Documentation\Datasheets\_BOITIERS\PASSIF_CMS\; Config: *; ComponentLink1Description: Datasheet; ComponentLink2Description: Datasheet Boitier; Supplier 1: Mouser; Supplier Part Number 1: 71-CRCW06032M49FKEA; Supplier 2: Farnell; Supplier Part Number 2: 1652870RL
R91 = RES_0603_1%_100PPM_237K: Résistance, 0.100W, 1%, 100ppm, 75V, 237K; Creation: PDP (20/09/12); Boitier: 0603; Remarque: {Remarque}; Fabricant: Vishay; Ref Fab: CRCW0603237KFKEA; Coeff: 1; Verification: *; ComponentLink1URL: O:\_Documentation\Datasheets\Vishay\Resistances_D-CRCWe3.pdf; ComponentLink2URL: o:\_Documentation\Datasheets\_BOITIERS\PASSIF_CMS\; Config: *; ComponentLink1Description: Datasheet; ComponentLink2Description: Datasheet Boitier; Supplier 1: Mouser; Supplier Part Number 1: 71-CRCW0603-237K-E3; Supplier 2: Farnell; Supplier Part Number 2: 2138533
R95 = RES_0603_1%_100PPM_9.76K: Résistance, 0.100W, 1%, 100ppm, 75V, 9.76K; Creation: PDP (20/09/12); Boitier: 0603; Remarque: {Remarque}; Fabricant: Vishay; Ref Fab: CRCW06039K76FKEA; Coeff: 1; ComponentLink1URL: O:\_Documentation\Datasheets\Vishay\Resistances_D-CRCWe3.pdf; ComponentLink2URL: o:\_Documentation\Datasheets\_BOITIERS\PASSIF_CMS\; Config: *; ComponentLink1Description: Datasheet; ComponentLink2Description: Datasheet Boitier; Supplier 1: Farnell; Supplier Part Number 1: 1152160; Supplier 2: Mouser; Supplier Part Number 2: 71-CRCW0603-9.76K-E3
T14 = NTD2955G: Transistor Mosfet P, Vdss=60V, Id=12A, Rdson=0.155R, -55/+175°C, CMS; Boitier: DPAK; Creation: PDP (13/07/12); Coeff: 1; Fabricant: ON Semiconductor; Verification: *; ComponentLink1URL: O:\_Documentation\Datasheets\ON_Semiconductors\NTD2955.PDF; ComponentLink2URL: o:\_Documentation\Datasheets\_BOITIERS\ACTIF_CMS\; Config: *; ComponentLink1Description: Datasheet; Ref Fab: NTD2955G; Supplier 1: Farnell; Supplier Part Number 1: 2101431; Supplier 2: Mouser; Supplier Part Number 2: 863-NTD2955G; ComponentLink2Description: Datasheet Boitier; Value: NTD2955G
T27 T29 = NTMS4801N: Transistor MOSN logique, Vdss=30V, Id=12A, Rdson=0.012R, CMS; Boitier: SO-8; Remarque: {Remarque}; Creation: PDP (20/09/12); Fabricant: ON Semiconductor; Ref Fab: NTMS4801NR2G; Coeff: 1; ComponentLink1URL: o:\_Documentation\Datasheets\; ComponentLink2URL: o:\_Documentation\Datasheets\_BOITIERS\ACTIF_CMS\; Config: *; ComponentLink1Description: O:\_Documentation\Datasheets\ON_Semiconductors\NTMS4801N-D.PDF; ComponentLink1Description: Datasheet; Value: NTMS4801N; Supplier 1: Mouser; Supplier Part Number 1: 863-NTMS4801NR2G; ComponentLink2Description: Datasheet Boitier
T66 = BC847C: Transistor NPN, Vce=50V, Ic=0.1A, hfe=420~800, 0.25W, CMS; Creation: GO (08/07/05); Verification: LJ (21/07/05); Reference: 000329/00; Boitier: SOT23_3L; Remarque: Complementaires aux BC856-860; Fabricant: NXP; Coeff: 1; Ref Fab: BC847C; ComponentLink1URL: O:\_Documentation\Datasheets\NXP\BC847.pdf; ComponentLink2URL: o:\_Documentation\Datasheets\_BOITIERS\ACTIF_CMS\SOT\SOT_23_3P_(Schneider).PDF; Config: *; ComponentLink1Description: Datasheet; Value: BC847C; Supplier 1: Farnell; Supplier Part Number 1: 1081235; ComponentLink2Description: Datasheet Boitier
Title_new#2 = Title_new
U12 = LM3150MH: Syncronous Buck Controller,  Vin=6~42V, -40/+125°C, CMS; Creation: PDP (20/09/12); Boitier: eTSSOP-14; Remarque: {Remarque}; Coeff: 1; Fabricant: National Semiconductor; ComponentLink1URL: \\SRV-MASTER\outils\_Documentation\Datasheets\National_SemiConductors\LM3150.pdf; ComponentLink2URL: o:\_Documentation\Datasheets\_Boitiers\ACTIF_CMS\; ComponentLink1Description: Datasheet; ComponentLink2Description: Datasheet Boitier; Ref Fab: LM3150MH; Supplier 1: Mouser; Supplier Part Number 1: 926-LM3150MH/NOPB
VR1 = VDR_V300LA10P: Varistance disque 300Vac, 46J, Vbreak=420V@1mA, Vclamp=775V@50A, Ipeak=4500A; Creation: ZA (24/04/13); Boitier: d10_h16_e7.5mm; Remarque: {Remarque}; Coeff: 1; Fabricant: Littelfuse; ComponentLink1URL: o:\_Documentation\Datasheets\Littelfuse\Varistances_LA.pdf; ComponentLink2URL: o:\_Documentation\Datasheets\Littelfuse\Varistances_LA.pdf; Config: *; ComponentLink1Description: Datasheet; ComponentLink2Description: Datasheet Boitier; Ref Fab: V300LA10P; Supplier 1: Farnell; Supplier Part Number 1: 1816960; Supplier 2: Mouser; Supplier Part Number 2: 576-V300LA10

## Sheet SDEC944-xD_Alimentation_2-2.SchDoc: Alimentation 2/2
size 393 x 270 mm; CompanyName: Seccom; Address1: 521, rue du capt. François Garbit; Address2: 69440 Mornant; Address3: seccom@seccom.fr; Address4: www.seccom.fr; DocumentNumber: 3; SheetNumber: 3; SheetTotal: 22; PageSetup: Record=PageOptions|CenterHorizontal=True|CenterVertical=True|PrintScale=0.74|XCorrection=1.00|YCorrection=1.00|PrintKind=0|BorderSize=5000000|LeftOffset=0|BottomOffset=0|Orientation=2|PaperLength=1000|PaperWidth=1000|Scale=100|PaperSource=7|PrintQuality=-4|MediaType=1|DitherType=10|PaperKind=A4|PrintScaleMode=1
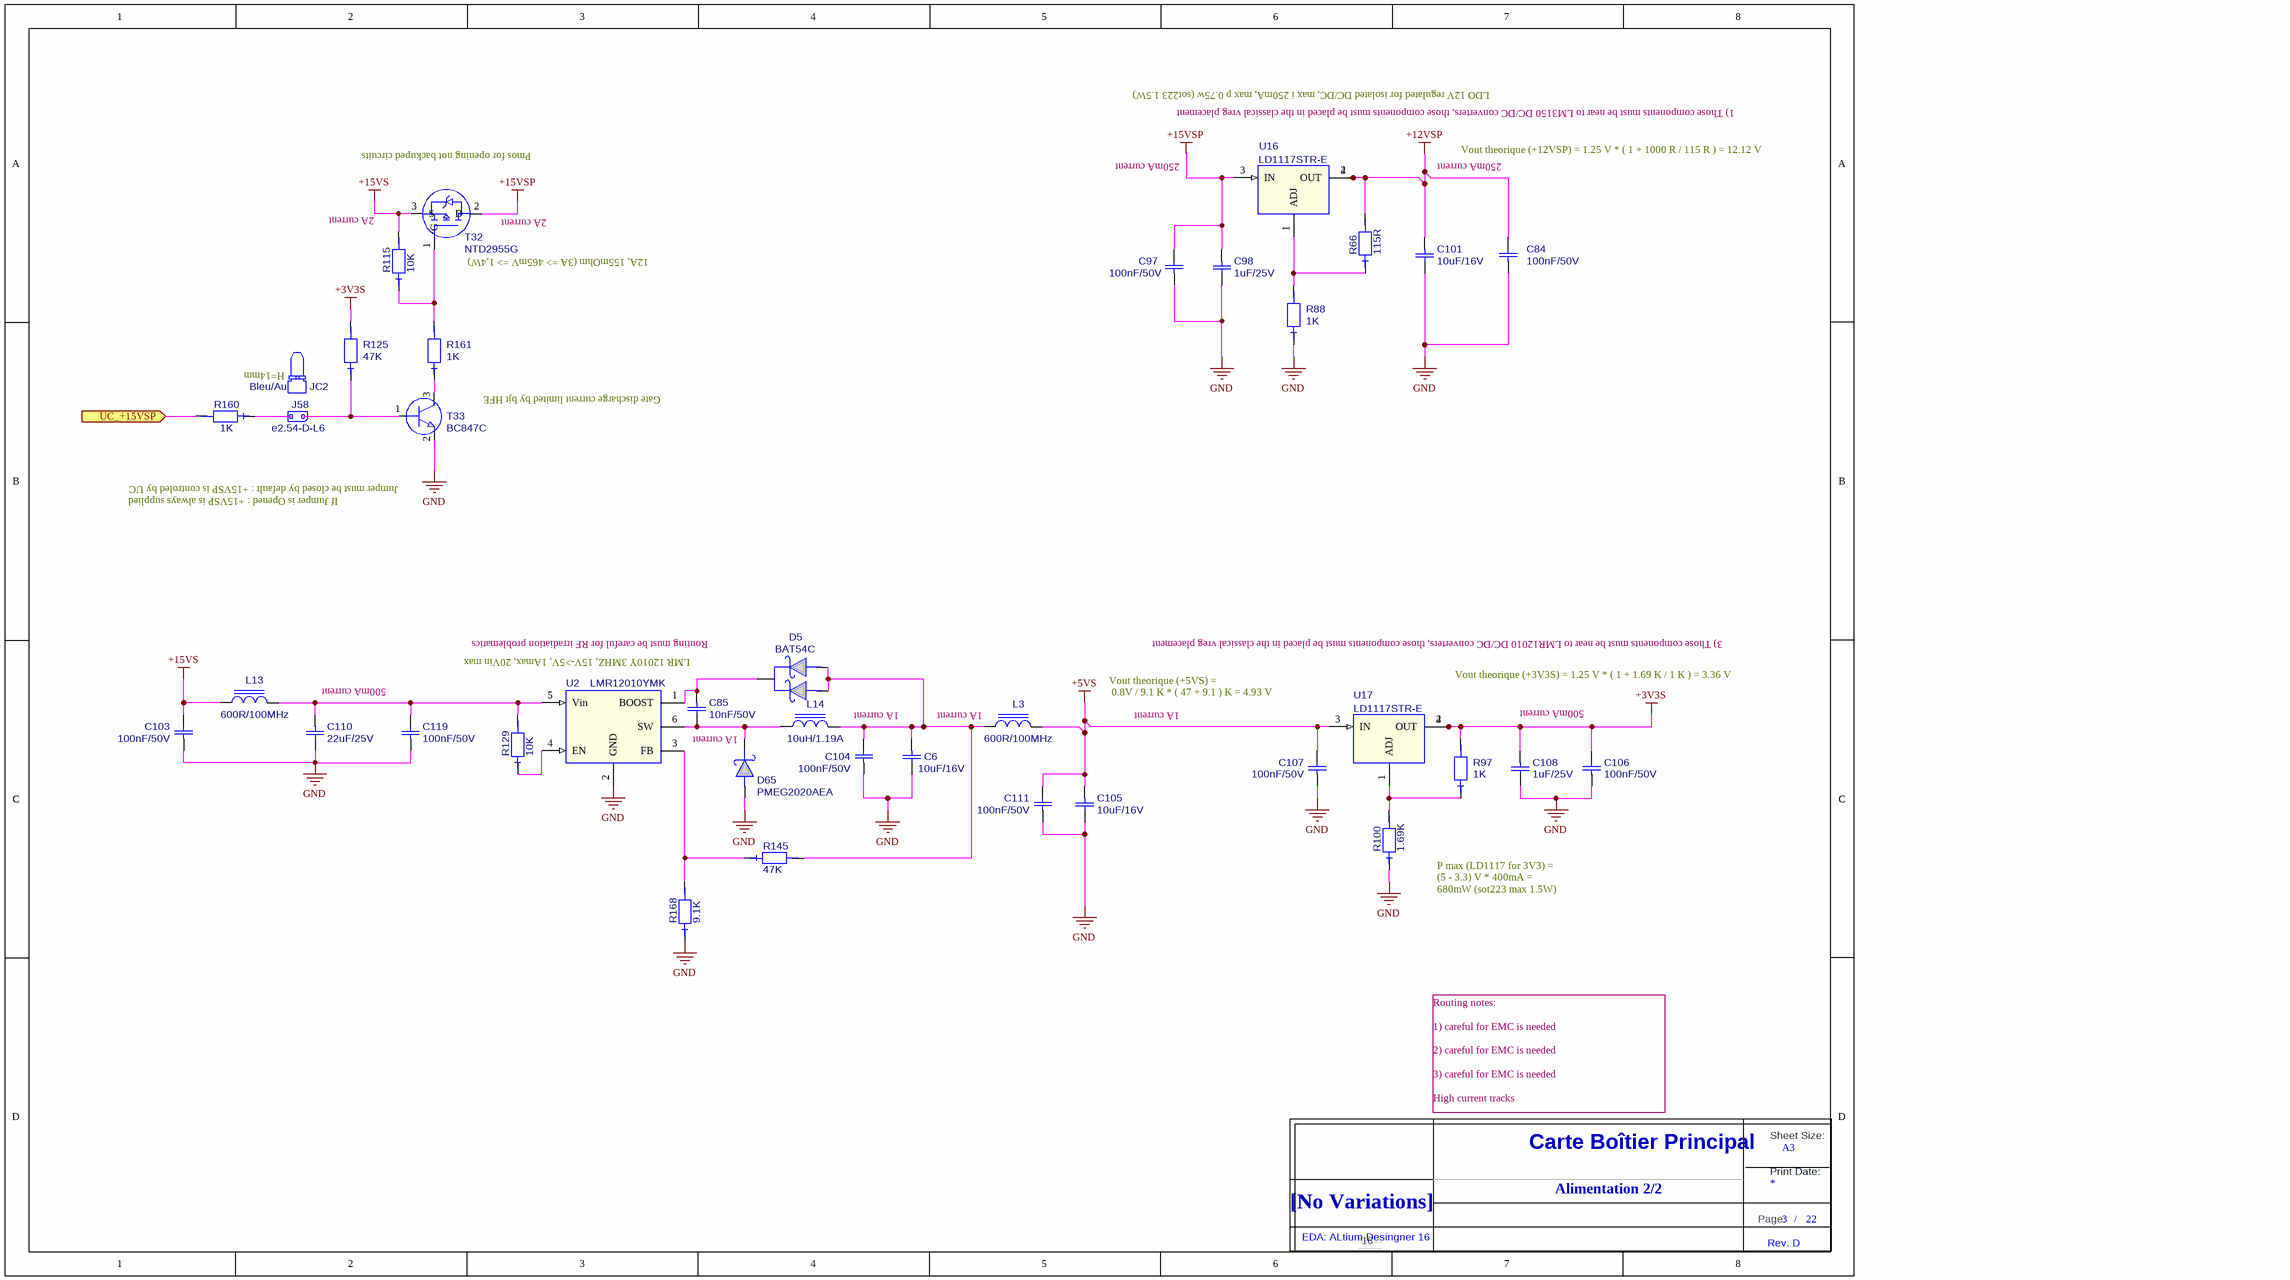
[diagram p2: SDEC944-xD_Alimentation_2-2.SchDoc]

### Parts
(Parts that share a designator on the sheet are numbered #1, #2 ... from top to bottom, then left to right.)
C6  value 10uF/16V  [0805_ReflowSoldering_CAP]  (hidden comment: C_0805_X5R_10%_10U-16V)
C84  value 100nF/50V  [0603_ReflowSoldering_CAP]  (hidden comment: C_0603_X7R_10%_100N-50V)
C85  value 10nF/50V  [0603_ReflowSoldering_CAP]  (hidden comment: C_0603_X7R_10%_10N-50V)
C97  value 100nF/50V  [0603_ReflowSoldering_CAP]  (hidden comment: C_0603_X7R_10%_100N-50V)
C98  value 1uF/25V  [0805_ReflowSoldering_CAP]  (hidden comment: C_0805_X5R_10%_1U-25V)
C101  value 10uF/16V  [0805_ReflowSoldering_CAP]  (hidden comment: C_0805_X5R_10%_10U-16V)
C103  value 100nF/50V  [0603_ReflowSoldering_CAP]  (hidden comment: C_0603_X7R_10%_100N-50V)
C104  value 100nF/50V  [0603_ReflowSoldering_CAP]  (hidden comment: C_0603_X7R_10%_100N-50V)
C105  value 10uF/16V  [0805_ReflowSoldering_CAP]  (hidden comment: C_0805_X5R_10%_10U-16V)
C106  value 100nF/50V  [0603_ReflowSoldering_CAP]  (hidden comment: C_0603_X7R_10%_100N-50V)
C107  value 100nF/50V  [0603_ReflowSoldering_CAP]  (hidden comment: C_0603_X7R_10%_100N-50V)
C108  value 1uF/25V  [0805_ReflowSoldering_CAP]  (hidden comment: C_0805_X5R_10%_1U-25V)
C110  value 22uF/25V  [1206_ReflowSoldering_CAP]  (hidden comment: C_1206_X5R_20%_22U-25V)
C111  value 100nF/50V  [0603_ReflowSoldering_CAP]  (hidden comment: C_0603_X7R_10%_100N-50V)
C119  value 100nF/50V  [0603_ReflowSoldering_CAP]  (hidden comment: C_0603_X7R_10%_100N-50V)
D5  BAT54C  [SOT23_3L_ReflowSoldering]
D65  PMEG2020AEA  [SOD323_ReflowSoldering]
J58  value e2.54-D-L6  [BAR_M_1X02D_L6_IS2.6_E2.54_G]  (hidden comment: CAVALIER_EMBASE_2PTS_E2.54)
JC2  value Bleu/Au  [NULL]  (hidden comment: CAVALIER_2.54_BLEU_DORE_LANGUETTE_14mm)
L3  value 600R/100MHz  [1206_ReflowSoldering_FERRITE]  (hidden comment: IND_FERRITE_1206_74279218)
L13  value 600R/100MHz  [1206_ReflowSoldering_FERRITE]  (hidden comment: IND_FERRITE_1206_74279218)
L14  value 10uH/1.19A  [SELF_WE-TPC_4.8x4.78_(type4828)]  (hidden comment: SELF_10UH_1.19A_744043100)
R66  value 115R  [0603_ReflowSoldering_RES]  (hidden comment: RES_0603_1%_100PPM_115R)
R88  value 1K  [0603_ReflowSoldering_RES]  (hidden comment: RES_0603_1%_100PPM_1K)
R97  value 1K  [0603_ReflowSoldering_RES]  (hidden comment: RES_0603_1%_100PPM_1K)
R100  value 1.69K  [0603_ReflowSoldering_RES]  (hidden comment: RES_0603_1%_100PPM_1.69K)
R115  value 10K  [0603_ReflowSoldering_RES]  (hidden comment: RES_0603_1%_100PPM_10K)
R125  value 47K  [0603_ReflowSoldering_RES]  (hidden comment: RES_0603_1%_100PPM_47K)
R129  value 10K  [0603_ReflowSoldering_RES]  (hidden comment: RES_0603_1%_100PPM_10K)
R145  value 47K  [0603_ReflowSoldering_RES]  (hidden comment: RES_0603_1%_100PPM_47K)
R160  value 1K  [0603_ReflowSoldering_RES]  (hidden comment: RES_0603_1%_100PPM_1K)
R161  value 1K  [0603_ReflowSoldering_RES]  (hidden comment: RES_0603_1%_100PPM_1K)
R168  value 9.1K  [0603_ReflowSoldering_RES]  (hidden comment: RES_0603_1%_100PPM_9.1K)
T32  NTD2955G  [DPAK_Specifique_1]
T33  BC847C  [SOT23_3L_ReflowSoldering]
Title_new#3  DNI  (value not drawn)  (graphical)
U2  LMR12010YMK  [SOT23_6L]
U16  LD1117STR-E  [SOT223]
U17  LD1117STR-E  [SOT223]

### Ports
UC_+15VSP (in)

### Nets
+3V3S: C106.1 C108.2 R97.2 R125.2 U17.2(OUT) U17.4(OUT)
+5VS: C105.2 C107.1 C111.1 L3.2 U17.3(IN)
+12VSP: C84.1 C101.2 R66.2 U16.2(OUT) U16.4(OUT)
+15VS: C103.1 L13.1 R115.2 T32.3(S)
+15VSP: C97.1 C98.2 T32.2(D) U16.3(IN)
GND: C6.1 C84.2 C97.2 C98.1 C101.1 C103.2 C104.2 C105.1 C106.2 C107.2 C108.1 C110.1 C111.2 C119.2 D65.A R88.1 R100.1 R168.1 T33.2(E) U2.2(GND)
UC_+15VSP: R160.2 ; port UC_+15VSP
NetC6_2: C6.2 C104.1 D5.1 D5.2 L3.1 L14.2 R145.2
NetC85_1: C85.1 D65.K L14.1 U2.6(SW)
NetC85_2: C85.2 D5.3 U2.1(BOOST)
NetC110_2: C110.2 C119.1 L13.2 R129.2 U2.5(Vin)
NetJ58_1: J58.1 R125.1 T33.1(B)
NetJ58_2: J58.2 R160.1
NetR66_1: R66.1 R88.2 U16.1(ADJ)
NetR97_1: R97.1 R100.2 U17.1(ADJ)
NetR115_1: R115.1 R161.2 T32.1(G)
NetR129_1: R129.1 U2.4(EN)
NetR145_1: R145.1 R168.2 U2.3(FB)
NetR161_1: R161.1 T33.3(C)

Not connected (* = marked no-connect by the designer): L14 3 4 5 6

### Notes on the sheet
- LDO 12V regulated for isolated DC/DC, max i 250mA, max p 0.75w (sot223 1.5W)
- 1) Those components must be near to LM3150 DC/DC converters, those components must be placed in the classical vreg placement
- Pmos for opening not backuped circuits
- 250mA current
- Vout theorique (+12VSP) = 1.25 V * ( 1 + 1000 R / 115 R ) = 12.12 V
- 2A current
- (near T32) 2A current
- (near T32) 12A, 155mOhm (3A => 465mV => 1,4W)
- (near JC2) H=14mm
- (near T33) Gate discharge current limited by bjt HFE
- If Jumper is Opened : +15VSP is always supplied
- Jumper must be closed by default : +15VSP is controled by UC
- Routing must be careful for RF irradiation problematics
- 3) Those components must be near to LMR12010 DC/DC converters, those components must be placed in the classical vreg placement
- 500mA current
- LMR 12010Y 3MHZ, 15V->5V, 1Amax, 20Vin max
- 1A current
- (near L3) 1A current
- Vout theorique (+5VS) =
  0.8V / 9.1 K * ( 47 + 9.1 ) K = 4.93 V
- Vout theorique (+3V3S) = 1.25 V * ( 1 + 1.69 K / 1 K ) = 3.36 V
- P max (LD1117 for 3V3) =
  (5 - 3.3) V * 400mA =
  680mW (sot223 max 1.5W)
- Routing notes:
  1) careful for EMC is needed
  2) careful for EMC is needed
  3) careful for EMC is needed
  High current tracks
- Alimentation 2/2
- 16
- (in symbol Title_new) Sheet Size:; Carte Boîtier Principal; A3; Print Date:; [No Variations]; Page:; /; EDA: ALtium Desingner 16; Rev. D

### Library data of the parts
C6 C101 C105 = C_0805_X5R_10%_10U-16V: Condensateur céramique, X5R, 10%, CMS 0805, 10uF/16V; Creation: FB (02/10/12); Boitier: 0805; Remarque: {Remarque}; Coeff: 1; Fabricant: Kemet; Ref Fab: C0805C106K4PAC; Verification: *; ComponentLink1URL: O:\_Documentation\Datasheets\Kemet\Condos_Ceramic_CMS.pdf; ComponentLink2URL: o:\_Documentation\Datasheets\_Boitiers\PASSIF_CMS\RC_0805_(2x1,25)_(Schneider).pdf; Config: *; ComponentLink1Description: Datasheet; ComponentLink2Description: Datasheet Boitier
C84 C97 C103 C104 C106 C107 C111 C119 = C_0603_X7R_10%_100N-50V: as C48 on sheet SDEC944-xD_Alimentation_1-2; ComponentLink1URL: O:\_Documentation\Datasheets\Kemet\Condos_Ceramic_CMS.pdf; ComponentLink2URL: o:\_Documentation\Datasheets\_BOITIERS\PASSIF_CMS\; Config: *; ComponentLink1Description: Datasheet; ComponentLink2Description: Datasheet Boitier; Supplier 1: Farnell; Supplier Part Number 1: 1288255
C85 = C_0603_X7R_10%_10N-50V: Condensateur céramique, X7R, 10%, CMS 0603; Creation: CHD; Boitier: 0603; Remarque: {Remarque}; Coeff: 1; Fabricant: Kemet; Ref Fab: C0603C103K5RAC; ComponentLink1URL: o:\_Documentation\Datasheets\Kemet\Condos_Ceramic_CMS.pdf; ComponentLink2URL: o:\_Documentation\Datasheets\_BOITIERS\PASSIF_CMS\; Config: *; ComponentLink1Description: Datasheet; ComponentLink2Description: Datasheet Boitier; Supplier 1: Farnell; Supplier Part Number 1: 1414609
C98 C108 = C_0805_X5R_10%_1U-25V: as C66 on sheet SDEC944-xD_Alimentation_1-2; Verification: *; ComponentLink1URL: O:\_Documentation\Datasheets\AVX\Condensateurs_CMS_Ceramic_X5R.pdf; ComponentLink2URL: o:\_Documentation\Datasheets\_Boitiers\PASSIF_CMS\RC_0805_(2x1,25)_(Schneider).pdf; Config: *; ComponentLink1Description: Datasheet; ComponentLink2Description: Datasheet Boitier; Supplier Part Number 1: 1327695; Supplier Part Number 2: 6983409; Supplier 1: Farnell; Supplier 2: Radiospares
C110 = C_1206_X5R_20%_22U-25V: as C51 on sheet SDEC944-xD_Alimentation_1-2; Verification: *; ComponentLink1URL: O:\_Documentation\Datasheets\TDK\general_B11.pdf; ComponentLink2URL: o:\_Documentation\Datasheets\_BOITIERS\PASSIF_CMS\; ComponentLink1Description: Datasheet; ComponentLink2Description: Datasheet Boitier; Supplier 1: Farnell; Supplier Part Number 1: 2354129; Supplier 2: Mouser; Supplier Part Number 2: 810-C3216X5R1E226M
D5 = BAT54C: Diode Schottky double, BAT54 cathode com, Vrrm=30V, If=300mA, Vf=0.4Vmax, CMS; Creation: LJ (14/05/02); Reference: 000597/00; Boitier: SOT23_3L; Remarque: {Remarque}; Coeff: 1; Fabricant: NXP; Verification: LJ (14/05/02); ComponentLink1URL: O:\_Documentation\Datasheets\NXP\BAT54_series.pdf; ComponentLink2URL: o:\_Documentation\Datasheets\_BOITIERS\ACTIF_CMS\SOT\SOT_23_3P_(Schneider).PDF; Config: *; ComponentLink1Description: Datasheet; ComponentLink2Description: Datasheet Boitier; Ref Fab: BAT54C; Supplier 1: Farnell; Supplier Part Number 1: 1081192; Value: BAT54C
D65 = PMEG2020AEA: Diode Schottky, Vrrm=20V, If=2A, Vf=0.45V, CMS; Creation: PDP (10/07/12); Boitier: SOD323; Remarque: {Remarque}; Coeff: 1; Fabricant: NXP; Verification: *; ComponentLink1URL: o:\_Documentation\Datasheets\NXP\PMEG2020AEA.PDF; ComponentLink2URL: o:\_Documentation\Datasheets\_BOITIERS\ACTIF_CMS\SOD\SOD_80_(MLL34)_(Schneider).PDF; Config: *; ComponentLink1Description: Datasheet; ComponentLink2Description: Datasheet Boitier; Ref Fab: PMEG2020AEA; Value: PMEG2020AEA
J58 = CAVALIER_EMBASE_2PTS_E2.54: Barrette, e2.54, mâle, 1x2 picots 0.635², droit, long. contact 6, isol. 2.6mm, doré; Creation: LJ; Reference: 000048/02; Boitier: 1x02_e2.54_drt_L6mm; Remarque: Longueur contact idéale pour accueillir HE10; Verification: LJ (13/11/03); Coeff: 1; Fabricant: Samtec; Ref Fab: TSW-102-24-L-S; ComponentLink1URL: o:\_Documentation\Datasheets\Samtec\TSW_TH.PDF; Config: *; ComponentLink1Description: Datasheet; ComponentLink2Description: Datasheet Boitier
JC2 = CAVALIER_2.54_BLEU_DORE_LANGUETTE_14mm: Cavalier (Jumper) doré 2 points pour barrette au pas de 2.54mm, BLEU, avec languette, Hauteur globale 14mm, 3A, 250V; Creation: ZA (07/11/12); Boitier: 5.08x2.54_h14_e2.54mm; Remarque: {Remarque}; Coeff: 1; Fabricant: Harwin; Ref Fab: M7683-05; ComponentLink1URL: o:\_Documentation\Datasheets\Harwin\M7680-M7683.pdf; ComponentLink2URL: o:\_Documentation\Datasheets\Harwin\M7680-M7683.pdf; Config: *; ComponentLink2Description: Datasheet Boitier; ComponentLink1Description: Datasheet; Supplier 1: Farnell; Supplier Part Number 1: 3218466; Supplier 2: Mouser; Supplier Part Number 2: 855-M7683-05
L3 L13 = IND_FERRITE_1206_74279218: Inductance à ferrite multicouches CMS, imp=600R@100MHz, +/-25%, Rdc=100mR, I=2A; Creation: LJ (12/08/08); Reference: 000049/00; Boitier: 1206; Remarque: Alternative aux selfs de choc; Coeff: 1; Fabricant: Wurth Elektronik; Verification: *; ComponentLink1URL: o:\_Documentation\Datasheets\Wurth_Elektronik\74279218.pdf; ComponentLink2URL: o:\_Documentation\Datasheets\_Boitiers\PASSIF_CMS\RC_1206_(3,2x1,6)_(Schneider).pdf; Config: *; ComponentLink1Description: Datasheet; ComponentLink2Description: Datasheet Boitier; Ref Fab: 74279218
L14 = SELF_10UH_1.19A_744043100: Inductance bobinée CMS, 10uH +/- 10%, I=1.19A, Rdc=0.095R, SRF=40MHz, -40/+85°C; Creation: LJ (02/08/12); Boitier: 4.8x4.8_h2.8mm; Coeff: 1; Fabricant: Wurth Elektronik; Verification: *; ComponentLink1URL: O:\_Documentation\Datasheets\Wurth_Elektronik\744043100.pdf; ComponentLink2URL: O:\_Documentation\Datasheets\Wurth_Elektronik\744043100.pdf; Remarque: *; Config: *; ComponentLink1Description: Datasheet; ComponentLink2Description: Datasheet Boitier; Ref Fab: 744043100
R66 = RES_0603_1%_100PPM_115R: Résistance, 0.100W, 1%, 100ppm, 75V, 115R; Creation: PDP (03/10/12); Boitier: 0603; Remarque: {Remarque}; Fabricant: Vishay; Ref Fab: CRCW0603115RFKEA; Coeff: 1; Verification: *; ComponentLink1URL: O:\_Documentation\Datasheets\Vishay\Resistances_D-CRCWe3.pdf; ComponentLink2URL: o:\_Documentation\Datasheets\_BOITIERS\PASSIF_CMS\; Config: *; ComponentLink1Description: Datasheet; ComponentLink2Description: Datasheet Boitier; Supplier 1: Mouser; Supplier Part Number 1: 71-CRCW0603-115-E3; Supplier 2: Farnell; Supplier Part Number 2: 2141284
R88 R97 R160 R161 = RES_0603_1%_100PPM_1K: Résistance, 0.100W, 1%, 100ppm, 75V, 1K; Creation: JPL (05/07/12); Boitier: 0603; Remarque: {Remarque}; Fabricant: Vishay; Ref Fab: CRCW06031K00FKEA; Coeff: 1; Verification: *; ComponentLink1URL: O:\_Documentation\Datasheets\Vishay\Resistances_D-CRCWe3.pdf; ComponentLink2URL: o:\_Documentation\Datasheets\_BOITIERS\PASSIF_CMS\; Config: *; ComponentLink1Description: Datasheet; ComponentLink2Description: Datasheet Boitier; Supplier 1: Farnell; Supplier 2: RadioSpares; Supplier Part Number 1: 1469740; Supplier Part Number 2: 6789875
R100 = RES_0603_1%_100PPM_1.69K: Résistance, 0.100W, 1%, 100ppm, 75V, 1.69K; Creation: PDP (03/10/12); Boitier: 0603; Remarque: {Remarque}; Fabricant: Vishay; Ref Fab: CRCW06031K69FKEA; Coeff: 1; Verification: *; ComponentLink1URL: O:\_Documentation\Datasheets\Vishay\Resistances_D-CRCWe3.pdf; ComponentLink2URL: o:\_Documentation\Datasheets\_BOITIERS\PASSIF_CMS\; Config: *; ComponentLink1Description: Datasheet; ComponentLink2Description: Datasheet Boitier; Supplier 1: Farnell; Supplier Part Number 1: 1692520; Supplier 2: Mouser; Supplier Part Number 2: 71-CRCW0603-1.69K-E3
R115 R129 = RES_0603_1%_100PPM_10K: Résistance, 0.100W, 1%, 100ppm, 75V, 10K; Creation: JPL (05/07/12); Boitier: 0603; Remarque: {Remarque}; Coeff: 1; Fabricant: Vishay; Ref Fab: CRCW060310K0FKEA; Verification: *; ComponentLink1URL: O:\_Documentation\Datasheets\Vishay\Resistances_D-CRCWe3.pdf; ComponentLink2URL: o:\_Documentation\Datasheets\_BOITIERS\PASSIF_CMS\; Config: *; ComponentLink1Description: Datasheet; ComponentLink2Description: Datasheet Boitier; Supplier 1: Farnell; Supplier Part Number 1: 1469748; Supplier 2: RadioSpares; Supplier Part Number 2: 6789667
R125 R145 = RES_0603_1%_100PPM_47K: as R63 on sheet SDEC944-xD_Alimentation_1-2; Verification: *; ComponentLink1URL: O:\_Documentation\Datasheets\Vishay\Resistances_D-CRCWe3.pdf; ComponentLink2URL: o:\_Documentation\Datasheets\_BOITIERS\PASSIF_CMS\; Config: *; ComponentLink1Description: Datasheet; ComponentLink2Description: Datasheet Boitier; Supplier 1: Farnell; Supplier 2: RadioSpares; Supplier Part Number 1: 1469811; Supplier Part Number 2: 6790425
R168 = RES_0603_1%_100PPM_9.1K: as R65 on sheet SDEC944-xD_Alimentation_1-2; ComponentLink1URL: O:\_Documentation\Datasheets\Vishay\Resistances_D-CRCWe3.pdf; ComponentLink2URL: o:\_Documentation\Datasheets\_BOITIERS\PASSIF_CMS\; Config: *; ComponentLink1Description: Datasheet; ComponentLink2Description: Datasheet Boitier; Supplier 1: Mouser; Supplier Part Number 1: 71-CRCW0603-9.1K-E3; Supplier 2: Farnell; Supplier Part Number 2: 1469842RL
T32 = NTD2955G: as T14 on sheet SDEC944-xD_Alimentation_1-2; Verification: *; ComponentLink1URL: O:\_Documentation\Datasheets\ON_Semiconductors\NTD2955.PDF; ComponentLink2URL: o:\_Documentation\Datasheets\_BOITIERS\ACTIF_CMS\; Config: *; ComponentLink1Description: Datasheet; Ref Fab: NTD2955G; Supplier 1: Farnell; Supplier Part Number 1: 2101431; Supplier 2: Mouser; Supplier Part Number 2: 863-NTD2955G; ComponentLink2Description: Datasheet Boitier; Value: NTD2955G
T33 = BC847C: as T66 on sheet SDEC944-xD_Alimentation_1-2; Ref Fab: BC847C; ComponentLink1URL: O:\_Documentation\Datasheets\NXP\BC847.pdf; ComponentLink2URL: o:\_Documentation\Datasheets\_BOITIERS\ACTIF_CMS\SOT\SOT_23_3P_(Schneider).PDF; Config: *; ComponentLink1Description: Datasheet; Value: BC847C; Supplier 1: Farnell; Supplier Part Number 1: 1081235; ComponentLink2Description: Datasheet Boitier
Title_new#3 = Title_new
U2 = LMR12010YMK: Régulateur ajustable step down, 0.8~20V, 1A, Vin=3~20V, -40/+125°C, CMS; Creation: PDP (10/07/12); Verification: LJ (02/08/12); Boitier: TSOT-6; Remarque: {Remarque}; Coeff: 1; Fabricant: National Semiconductor; ComponentLink1URL: O:\_Documentation\Datasheets\National_SemiConductors\LMR12010.pdf; ComponentLink2URL: o:\_Documentation\Datasheets\_Boitiers\ACTIF_CMS\; ComponentLink1Description: Datasheet; ComponentLink2Description: Datasheet Boitier; Ref Fab: LMR12010YMK; Value: LMR12010YMK; Supplier 1: Farnell; Supplier Part Number 1: 2060645; Supplier 2: Mouser; Supplier Part Number 2: 926-LMR12010YMKENOPB
U16 U17 = LD1117STR-E: Régulateur de tension ajustable positif, 1.25~15V, 0.8A, LDO (1V), Vin=15Vmax, CMS; Creation: LJ (04/07/11); Reference: 001683/00; Remarque: {Remarque}; Coeff: 1; Fabricant: ST; Boitier: SOT223; ComponentLink2URL: o:\_Documentation\Datasheets\_Boitiers\ACTIF_CMS\SOT & TSOT\SOT223_4_(Schneider).pdf; Config: *; ComponentLink1URL: o:\_Documentation\Datasheets\ST\LD1117.pdf; ComponentLink1Description: Datasheet; ComponentLink2Description: Datasheet Boitier; Ref Fab: LD1117STR-E; Value: LD1117STR-E